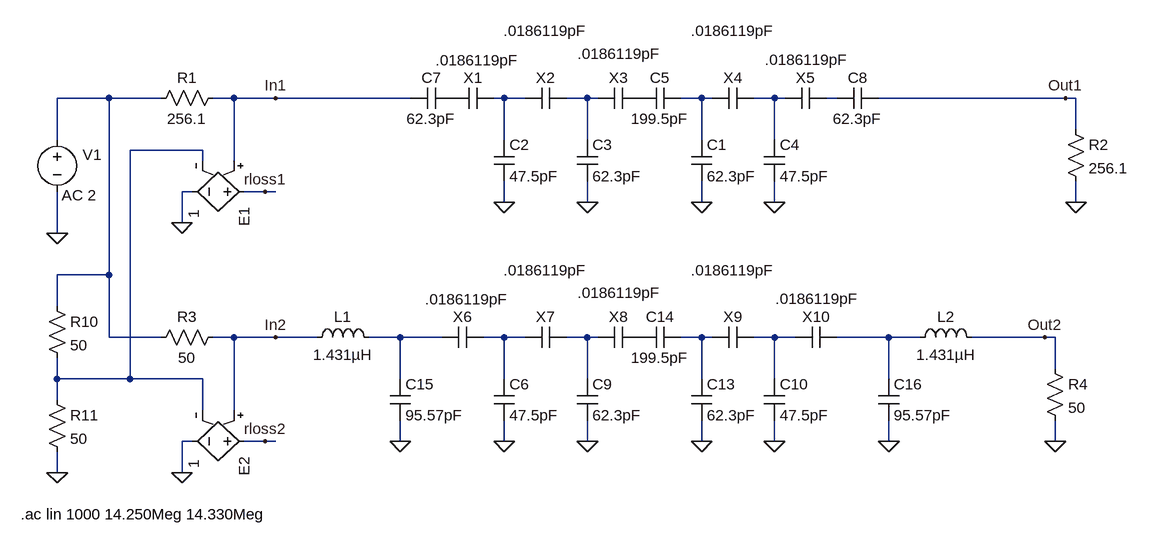
[diagram p0: schematic 5poleXtalBP14.317MHz.asc]
5poleXtalBP14.317MHz.asc, the LTspice schematic file:
Version 4
SHEET 1 1244 868
WIRE -560 -160 -640 -160
WIRE -480 -160 -560 -160
WIRE -368 -160 -400 -160
WIRE -304 -160 -368 -160
WIRE -96 -160 -304 -160
WIRE 48 -160 32 -160
WIRE 80 -160 48 -160
WIRE 176 -160 144 -160
WIRE 192 -160 176 -160
WIRE 352 -160 320 -160
WIRE 368 -160 352 -160
WIRE 464 -160 432 -160
WIRE 480 -160 464 -160
WIRE 560 -160 544 -160
WIRE 912 -160 624 -160
WIRE 928 -160 912 -160
WIRE 928 -112 928 -160
WIRE -640 -96 -640 -160
WIRE 48 -96 48 -160
WIRE 176 -96 176 -160
WIRE 352 -96 352 -160
WIRE 464 -96 464 -160
WIRE -416 -80 -528 -80
WIRE -416 -64 -416 -80
WIRE -368 -64 -368 -160
WIRE -432 -16 -448 -16
WIRE -320 -16 -352 -16
WIRE -304 -16 -320 -16
WIRE 48 0 48 -32
WIRE 176 0 176 -32
WIRE 352 0 352 -32
WIRE 464 0 464 -32
WIRE 928 0 928 -32
WIRE -448 32 -448 -16
WIRE -640 48 -640 -16
WIRE -560 112 -560 -160
WIRE -560 112 -640 112
WIRE -640 160 -640 112
WIRE -560 208 -560 112
WIRE -480 208 -560 208
WIRE -368 208 -400 208
WIRE -304 208 -368 208
WIRE -240 208 -304 208
WIRE -112 208 -160 208
WIRE -48 208 -112 208
WIRE 48 208 16 208
WIRE 80 208 48 208
WIRE 176 208 144 208
WIRE 192 208 176 208
WIRE 352 208 320 208
WIRE 368 208 352 208
WIRE 464 208 432 208
WIRE 496 208 464 208
WIRE 640 208 560 208
WIRE 688 208 640 208
WIRE 880 208 768 208
WIRE 896 208 880 208
WIRE 896 256 896 208
WIRE -640 272 -640 240
WIRE -528 272 -528 -80
WIRE -528 272 -640 272
WIRE -416 272 -528 272
WIRE -112 272 -112 208
WIRE 48 272 48 208
WIRE 176 272 176 208
WIRE 352 272 352 208
WIRE 464 272 464 208
WIRE 640 272 640 208
WIRE -640 304 -640 272
WIRE -416 320 -416 272
WIRE -368 320 -368 208
WIRE -432 368 -448 368
WIRE -320 368 -352 368
WIRE -304 368 -320 368
WIRE -112 368 -112 336
WIRE 48 368 48 336
WIRE 176 368 176 336
WIRE 352 368 352 336
WIRE 464 368 464 336
WIRE 640 368 640 336
WIRE 896 368 896 336
WIRE -640 416 -640 384
WIRE -448 416 -448 368
FLAG -640 48 0
FLAG -640 416 0
FLAG -448 32 0
FLAG -320 -16 rloss1
FLAG 48 0 0
FLAG 176 0 0
FLAG 464 0 0
FLAG 928 0 0
FLAG 912 -160 Out1
FLAG -448 416 0
FLAG -320 368 rloss2
FLAG -304 -160 In1
FLAG -304 208 In2
FLAG 352 0 0
FLAG 48 368 0
FLAG 176 368 0
FLAG 464 368 0
FLAG 896 368 0
FLAG 880 208 Out2
FLAG 352 368 0
FLAG -112 368 0
FLAG 640 368 0
SYMBOL cap -32 -144 R270
WINDOW 0 32 32 VTop 0
WINDOW 3 90 39 VBottom 0
SYMATTR InstName X1
SYMATTR Value .0186119pF
SYMATTR SpiceLine Rser=5.347 Lser=6.6437mH Cpar=4.4414pF
SYMBOL cap 32 -96 R0
SYMATTR InstName C2
SYMATTR Value 47.5pF
SYMBOL cap 160 -96 R0
SYMATTR InstName C3
SYMATTR Value 62.3pF
SYMBOL cap 448 -96 R0
SYMATTR InstName C4
SYMATTR Value 47.5pF
SYMBOL voltage -640 -112 R0
WINDOW 123 7 101 Left 0
WINDOW 39 0 0 Left 0
WINDOW 0 39 39 Left 0
SYMATTR Value2 AC 2
SYMATTR InstName V1
SYMATTR Value ""
SYMBOL res -656 144 R0
SYMATTR InstName R10
SYMATTR Value 50
SYMBOL res -656 288 R0
SYMATTR InstName R11
SYMATTR Value 50
SYMBOL e -336 -16 R90
WINDOW 3 28 94 Left 0
SYMATTR Value 1
SYMATTR InstName E1
SYMBOL res -496 -144 R270
WINDOW 0 32 56 VTop 0
WINDOW 3 0 56 VBottom 0
SYMATTR InstName R1
SYMATTR Value 256.1
SYMBOL res 912 -128 R0
SYMATTR InstName R2
SYMATTR Value 256.1
SYMBOL cap -96 -144 R270
WINDOW 0 32 32 VTop 0
WINDOW 3 0 32 VBottom 0
SYMATTR InstName C7
SYMATTR Value 62.3pF
SYMBOL cap 560 -144 R270
WINDOW 0 32 32 VTop 0
WINDOW 3 0 32 VBottom 0
SYMATTR InstName C8
SYMATTR Value 62.3pF
SYMBOL e -336 368 R90
WINDOW 3 28 94 Left 0
SYMATTR Value 1
SYMATTR InstName E2
SYMBOL res -496 224 R270
WINDOW 0 32 56 VTop 0
WINDOW 3 0 56 VBottom 0
SYMATTR InstName R3
SYMATTR Value 50
SYMBOL cap 80 -144 R270
WINDOW 0 32 32 VTop 0
WINDOW 3 135 32 VBottom 0
SYMATTR InstName X2
SYMATTR Value .0186119pF
SYMATTR SpiceLine Rser=5.347 Lser=6.6437mH Cpar=4.4414pF
SYMBOL cap 192 -144 R270
WINDOW 0 32 32 VTop 0
WINDOW 3 100 34 VBottom 0
SYMATTR InstName X3
SYMATTR Value .0186119pF
SYMATTR SpiceLine Rser=5.347 Lser=6.6437mH Cpar=4.4414pF
SYMBOL cap 368 -144 R270
WINDOW 0 32 32 VTop 0
WINDOW 3 135 32 VBottom 0
SYMATTR InstName X4
SYMATTR Value .0186119pF
SYMATTR SpiceLine Rser=5.347 Lser=6.6437mH Cpar=4.4414pF
SYMBOL cap 480 -144 R270
WINDOW 0 32 32 VTop 0
WINDOW 3 91 34 VBottom 0
SYMATTR InstName X5
SYMATTR Value .0186119pF
SYMATTR SpiceLine Rser=5.347 Lser=6.6437mH Cpar=4.4414pF
SYMBOL cap 336 -96 R0
SYMATTR InstName C1
SYMATTR Value 62.3pF
SYMBOL cap 256 -144 R270
WINDOW 0 32 32 VTop 0
WINDOW 3 0 32 VBottom 0
SYMATTR InstName C5
SYMATTR Value 199.5pF
SYMBOL cap -48 224 R270
WINDOW 0 32 32 VTop 0
WINDOW 3 90 39 VBottom 0
SYMATTR InstName X6
SYMATTR Value .0186119pF
SYMATTR SpiceLine Rser=5.347 Lser=6.6437mH Cpar=4.4414pF
SYMBOL cap 32 272 R0
SYMATTR InstName C6
SYMATTR Value 47.5pF
SYMBOL cap 160 272 R0
SYMATTR InstName C9
SYMATTR Value 62.3pF
SYMBOL cap 448 272 R0
SYMATTR InstName C10
SYMATTR Value 47.5pF
SYMBOL res 880 240 R0
SYMATTR InstName R4
SYMATTR Value 50
SYMBOL cap 80 224 R270
WINDOW 0 32 32 VTop 0
WINDOW 3 135 32 VBottom 0
SYMATTR InstName X7
SYMATTR Value .0186119pF
SYMATTR SpiceLine Rser=5.347 Lser=6.6437mH Cpar=4.4414pF
SYMBOL cap 192 224 R270
WINDOW 0 32 32 VTop 0
WINDOW 3 100 34 VBottom 0
SYMATTR InstName X8
SYMATTR Value .0186119pF
SYMATTR SpiceLine Rser=5.347 Lser=6.6437mH Cpar=4.4414pF
SYMBOL cap 368 224 R270
WINDOW 0 32 32 VTop 0
WINDOW 3 135 32 VBottom 0
SYMATTR InstName X9
SYMATTR Value .0186119pF
SYMATTR SpiceLine Rser=5.347 Lser=6.6437mH Cpar=4.4414pF
SYMBOL cap 496 224 R270
WINDOW 0 32 32 VTop 0
WINDOW 3 91 34 VBottom 0
SYMATTR InstName X10
SYMATTR Value .0186119pF
SYMATTR SpiceLine Rser=5.347 Lser=6.6437mH Cpar=4.4414pF
SYMBOL cap 336 272 R0
SYMATTR InstName C13
SYMATTR Value 62.3pF
SYMBOL cap 256 224 R270
WINDOW 0 32 32 VTop 0
WINDOW 3 0 32 VBottom 0
SYMATTR InstName C14
SYMATTR Value 199.5pF
SYMBOL ind -256 224 R270
WINDOW 0 32 56 VTop 0
WINDOW 3 5 56 VBottom 0
SYMATTR InstName L1
SYMATTR Value 1.431µH
SYMBOL cap -128 272 R0
SYMATTR InstName C15
SYMATTR Value 95.57pF
SYMBOL cap 624 272 R0
SYMATTR InstName C16
SYMATTR Value 95.57pF
SYMBOL ind 672 224 R270
WINDOW 0 32 56 VTop 0
WINDOW 3 5 56 VBottom 0
SYMATTR InstName L2
SYMATTR Value 1.431µH
TEXT -696 480 Left 0 !.ac lin 1000 14.250Meg 14.330Meg

The netlist it stands for:
* 5poleXtalBP14.317MHz.asc
C§X1 P001 N002 .0186119pF Rser=5.347 Lser=6.6437mH Cpar=4.4414pF
C2 N002 0 47.5pF
C3 N003 0 62.3pF
C4 N005 0 47.5pF
V1 N001 0 AC 2
R10 N001 N007 50
R11 N007 0 50
E1 rloss1 0 In1 N007 1
R1 N001 In1 256.1
R2 Out1 0 256.1
C7 In1 P001 62.3pF
C8 N006 Out1 62.3pF
E2 rloss2 0 In2 N007 1
R3 N001 In2 50
C§X2 N002 N003 .0186119pF Rser=5.347 Lser=6.6437mH Cpar=4.4414pF
C§X3 N003 P002 .0186119pF Rser=5.347 Lser=6.6437mH Cpar=4.4414pF
C§X4 N004 N005 .0186119pF Rser=5.347 Lser=6.6437mH Cpar=4.4414pF
C§X5 N005 N006 .0186119pF Rser=5.347 Lser=6.6437mH Cpar=4.4414pF
C1 N004 0 62.3pF
C5 P002 N004 199.5pF
C§X6 N008 N009 .0186119pF Rser=5.347 Lser=6.6437mH Cpar=4.4414pF
C6 N009 0 47.5pF
C9 N010 0 62.3pF
C10 N012 0 47.5pF
R4 Out2 0 50
C§X7 N009 N010 .0186119pF Rser=5.347 Lser=6.6437mH Cpar=4.4414pF
C§X8 N010 P003 .0186119pF Rser=5.347 Lser=6.6437mH Cpar=4.4414pF
C§X9 N011 N012 .0186119pF Rser=5.347 Lser=6.6437mH Cpar=4.4414pF
C§X10 N012 N013 .0186119pF Rser=5.347 Lser=6.6437mH Cpar=4.4414pF
C13 N011 0 62.3pF
C14 P003 N011 199.5pF
L1 In2 N008 1.431µH
C15 N008 0 95.57pF
C16 N013 0 95.57pF
L2 N013 Out2 1.431µH
.ac lin 1000 14.250Meg 14.330Meg
.backanno
.end